# Altium schematic sheet CON_FFC40_LCDTFT.SCHDOC: LCD Module Connector
size A4; DocumentNumber: 63; Revision: 01; SheetNumber: 64; SheetTotal: 78
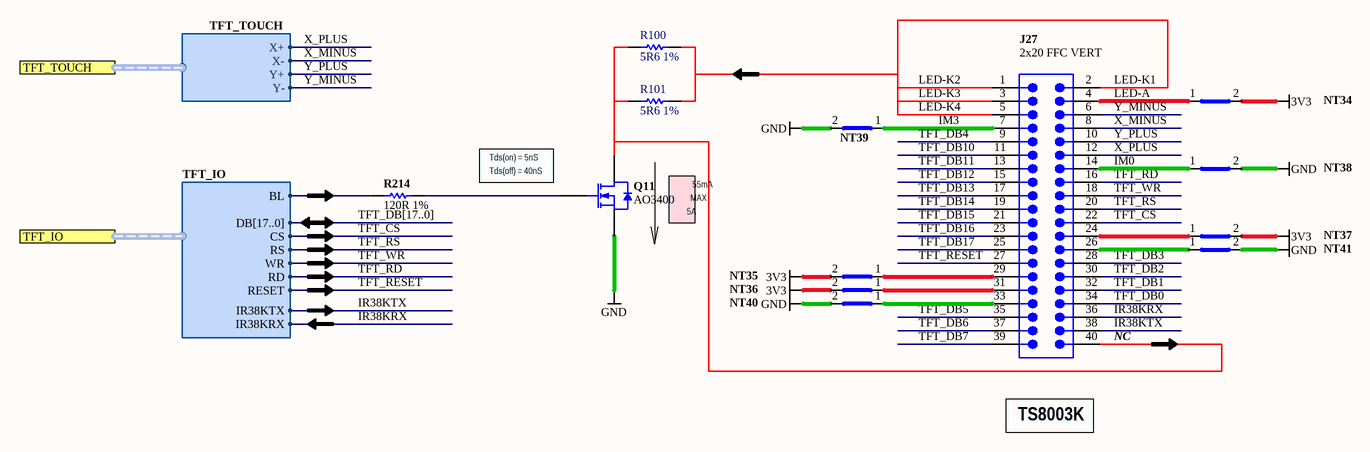
[diagram p0: CON_FFC40_LCDTFT.SCHDOC]

## Parts
J27  2x20 FFC VERT  [FPC-xxS1VN3R]
NT34  Net Tie SMT2  [NETTIE-SMT2-8X8]  (value not drawn)  (net tie, no BOM)
NT35  Net Tie SMT2  [NETTIE-SMT2-8X8]  (value not drawn)  (net tie, no BOM)
NT36  Net Tie SMT2  [NETTIE-SMT2-8X8]  (value not drawn)  (net tie, no BOM)
NT37  Net Tie SMT2  [NETTIE-SMT2-8X8]  (value not drawn)  (net tie, no BOM)
NT38  Net Tie SMT2  [NETTIE-SMT2-8X8]  (value not drawn)  (net tie, no BOM)
NT39  Net Tie SMT2  [NETTIE-SMT2-8X8]  (value not drawn)  (net tie, no BOM)
NT40  Net Tie SMT2  [NETTIE-SMT2-8X8]  (value not drawn)  (net tie, no BOM)
NT41  Net Tie SMT2  [NETTIE-SMT2-8X8]  (value not drawn)  (net tie, no BOM)
Q11  AO3400  [SOT95P230-3D]
R100  5R6 1%  [RESC1005-STAR]
R101  5R6 1%  [RESC1005-STAR]
R214  120R 1%  [RESC1005-STAR]

## Ports
TFT_IO (harness TFT_IO), TFT_TOUCH (harness TFT_TOUCH)

## Harnesses
TFT_IO: CS, RS, WR, RD, RESET, DB[17..0], BL, IR38KTX, IR38KRX
TFT_TOUCH: X+, X-, Y+, Y-

## Nets
3V3: NT34.2(Net2) NT35.2(Net2) NT36.2(Net2) NT37.2(Net2)
GND: NT38.2(Net2) NT39.2(Net2) NT40.2(Net2) NT41.2(Net2) Q11.3(S)
IR38KRX: J27.36 ; port TFT_IO.IR38KRX
IR38KTX: J27.38 ; port TFT_IO.IR38KTX
TFT_CS: J27.22 ; port TFT_IO.CS
TFT_DB0: J27.34
TFT_DB1: J27.32
TFT_DB2: J27.30
TFT_DB3: J27.28
TFT_DB4: J27.9
TFT_DB5: J27.35
TFT_DB6: J27.37
TFT_DB7: J27.39
TFT_DB10: J27.11
TFT_DB11: J27.13
TFT_DB12: J27.15
TFT_DB13: J27.17
TFT_DB14: J27.19
TFT_DB15: J27.21
TFT_DB16: J27.23
TFT_DB17: J27.25
TFT_RD: J27.16 ; port TFT_IO.RD
TFT_RESET: J27.27 ; port TFT_IO.RESET
TFT_RS: J27.20 ; port TFT_IO.RS
TFT_WR: J27.18 ; port TFT_IO.WR
X_MINUS: J27.8 ; port TFT_TOUCH.X-
X_PLUS: J27.12 ; port TFT_TOUCH.X+
Y_MINUS: J27.6 ; port TFT_TOUCH.Y-
Y_PLUS: J27.10 ; port TFT_TOUCH.Y+
NetJ27_1: J27.1 J27.2 J27.3 J27.5 R100.1 R101.1
NetJ27_4: J27.4 NT34.1(Net1)
NetJ27_7: J27.7 NT39.1(Net1)
NetJ27_14: J27.14 NT38.1(Net1)
NetJ27_24: J27.24 NT37.1(Net1)
NetJ27_26: J27.26 NT41.1(Net1)
NetJ27_29: J27.29 NT35.1(Net1)
NetJ27_31: J27.31 NT36.1(Net1)
NetJ27_33: J27.33 NT40.1(Net1)
NetJ27_40: J27.40 Q11.2(D) R100.2 R101.2
NetQ11_1: Q11.1(G) R214.1
NetR214_2: R214.2 ; port TFT_IO.BL

## Buses and harness runs
bus TFT_DB[17..0]

## Notes on the sheet
- LED-K3
- LED-K2
- LED-K4
- (near NT39) IM3
- LED-K1
- LED-A
- (near Q11) Tds(on) = 5nS
- (near Q11) Tds(off) = 40nS
- 55mA
- (near J27) IM0
- 5A
- MAX
- (near J27) NC
- TS8003K
- Sheet Title
- Project Title
- Size:
- Date:
- A4
- Assy:
- Time:
- Revision:
- Sheet
- of
- File:

## Library data of the parts
J27 = D-300-0125: Header FFC, 2x20 pin Vertical, 0.5mm; Connector type: Straight; Max Current: mA; Mounting Technology: Surface Mount; Pin Count: 40; Status: Unreleased; Category: Connector
NT34-NT41 = D-002-0003: Net-Tie, Surface Mount, 2 x 1.6mm x 0.8mm SMT Pads - For 0.8mm Track; Category: Net-Tie; Status: Production
Q11 = D-158-0005: N-channel Enhancement Mode Field-effect Transistor;  5.8A/30V; Transistor Type: NPN; Mounting Technology: Surface Mount; Status: Unreleased; Category: Transistor-FET
R100 R101 = D-100-0085: Resistor, 5R6 1% 0402 (1005); Power Rating: 63mW; Resistance: 5.6R; Category: Resistor; Mounting Technology: Surface Mount; Status: Production; Tolerance: 1%
R214 = D-100-0126: Resistor, 120R 1% 0402 (1005); Power Rating: 63 mW; Category: Resistor; Mounting Technology: Surface Mount; Resistance: 120 R; Status: Production; Tolerance: 1 %